# Altium schematic sheet TDS sensor 2.SchDoc
size A4; DocumentNumber: 4; SheetNumber: 4; SheetTotal: 4
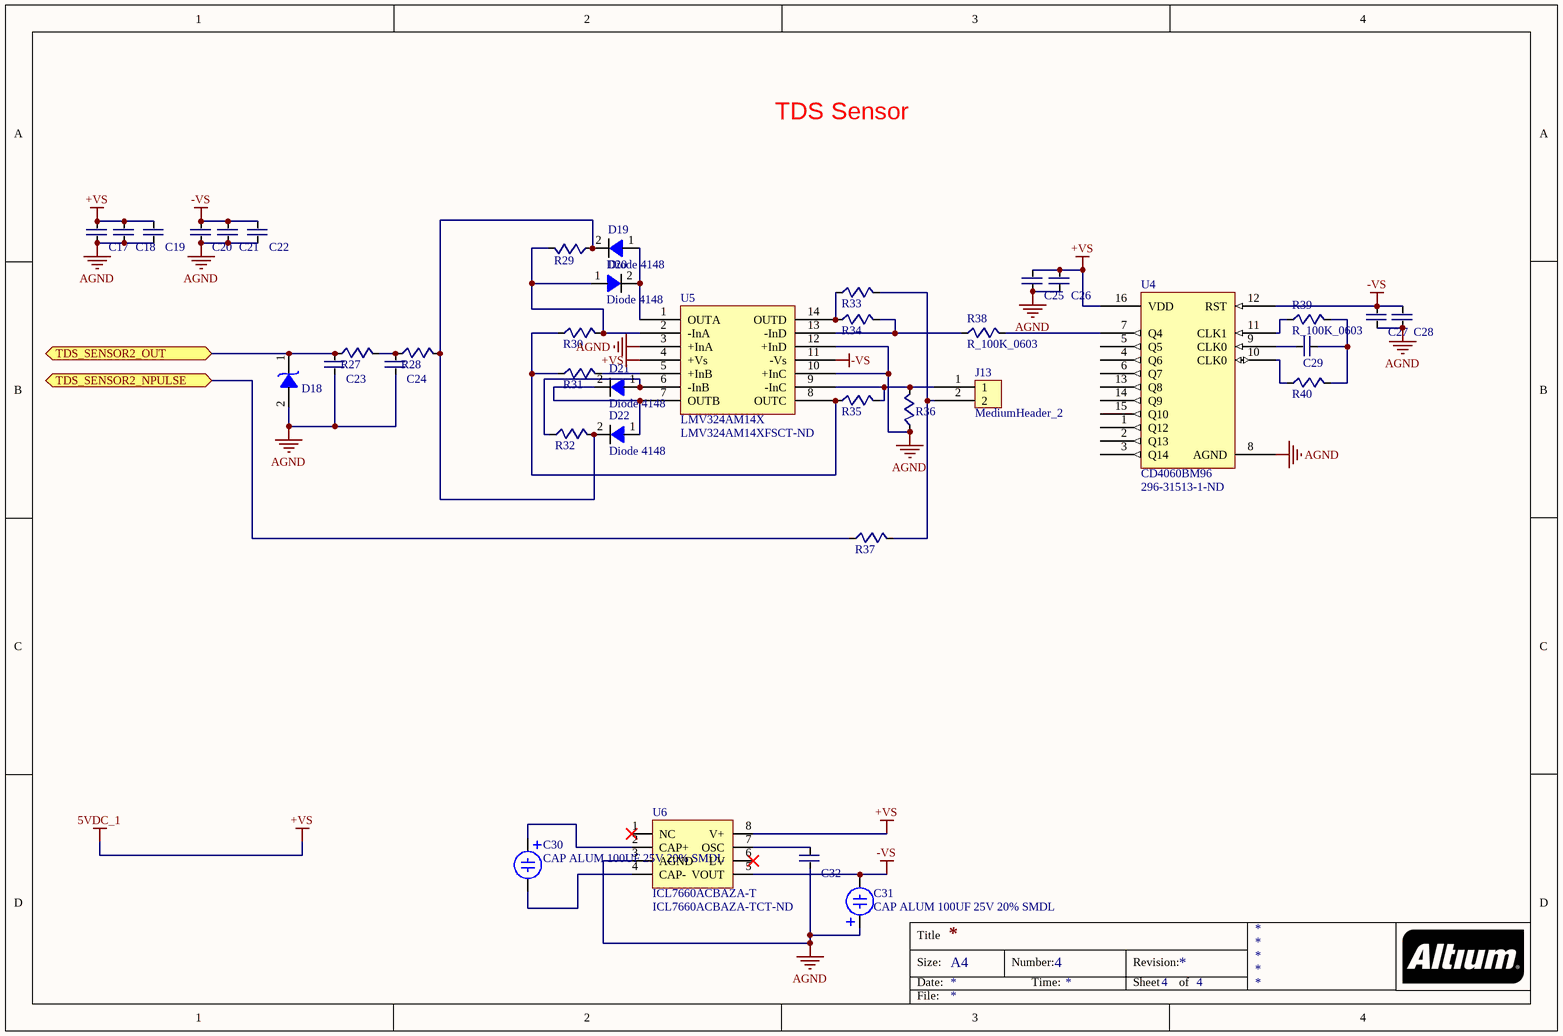
[diagram p0: TDS sensor 2.SchDoc]

## Parts
C17  100n Cer  [CN-SMD-0805]  (value not drawn)
C18  1n Cer  [CN-SMD-0805]  (value not drawn)
C19  10n Cer  [CN-SMD-0805]  (value not drawn)
C20  100n Cer  [CN-SMD-0805]  (value not drawn)
C21  1n Cer  [CN-SMD-0805]  (value not drawn)
C22  10n Cer  [CN-SMD-0805]  (value not drawn)
C23  10u Cer  [CN-SMD-0805]  (value not drawn)
C24  10u Cer  [CN-SMD-0805]  (value not drawn)
C25  10n Cer  [CN-SMD-0805]  (value not drawn)
C26  100n Cer  [CN-SMD-0805]  (value not drawn)
C27  10n Cer  [CN-SMD-0805]  (value not drawn)
C28  100n Cer  [CN-SMD-0805]  (value not drawn)
C29  1n Cer  [CN-SMD-0805]  (value not drawn)
C30  CAP ALUM 100UF 25V 20% SMDL  [CAPALU_SM_5.3x5.3]
C31  CAP ALUM 100UF 25V 20% SMDL  [CAPALU_SM_5.3x5.3]
C32  100n Cer  [CN-SMD-0805]  (value not drawn)
D18  Diode_SS34  [DO-214AB_MOD_EXT]  (value not drawn)
D19  Diode 4148  [CD3216-1206]
D20  Diode 4148  [CD3216-1206]
D21  Diode 4148  [CD3216-1206]
D22  Diode 4148  [CD3216-1206]
J13  MediumHeader_2  [Medium - Header 2]
R27  R_10K_0603  [RES-SMD-0603]  (value not drawn)
R28  R_10K_0603  [RES-SMD-0603]  (value not drawn)
R29  R_10K_0603  [RES-SMD-0603]  (value not drawn)
R30  R_10K_0603  [RES-SMD-0603]  (value not drawn)
R31  R_10K_0603  [RES-SMD-0603]  (value not drawn)
R32  R_10K_0603  [RES-SMD-0603]  (value not drawn)
R33  R_0R_0603  [RES-SMD-0603]  (value not drawn)
R34  R_4K99_0603  [RES-SMD-0603]  (value not drawn)
R35  R_4K99_0603  [RES-SMD-0603]  (value not drawn)
R36  R_1M_0603  [RES-SMD-0603]  (value not drawn)
R37  R_0R_0603  [RES-SMD-0603]  (value not drawn)
R38  R_100K_0603  [RES-SMD-0603]
R39  R_100K_0603  [RES-SMD-0603]
R40  R_10K_0603  [RES-SMD-0603]  (value not drawn)
U4  CD4060BM96  Supplier Part Number 1: 296-31513-1-ND  [SOIC_16]
U5  LMV324AM14X  Supplier Part Number 1: LMV324AM14XFSCT-ND  [SOIC-14]
U6  ICL7660ACBAZA-T  Supplier Part Number 1: ICL7660ACBAZA-TCT-ND  [SOIC-8_MOD_24LC128]

## Ports
TDS_SENSOR2_NPULSE, TDS_SENSOR2_OUT

## Nets
+VS: C17.2 C18.2 C19.2 C25.2 C26.2 U4.16(VDD) U5.4(+Vs) U6.8(V+)  [also labelled 5VDC_1]
-VS: C20.2 C21.2 C22.2 C27.2 C28.2 C31.2 U4.12(RST) U5.11(-Vs) U6.5(VOUT)
AGND: C17.1 C18.1 C19.1 C20.1 C21.1 C22.1 C23.1 C24.1 C25.1 C26.1 C27.1 C28.1 C31.1 C32.1 D18.2 R36.1 U4.8(AGND) U5.3(+InA) U5.10(+InC) U5.12(+InD) U6.3(AGND)
TDS_SENSOR2_NPULSE: R37.1 ; port TDS_SENSOR2_NPULSE
TDS_SENSOR2_OUT: C23.2 D18.1 R27.1 ; port TDS_SENSOR2_OUT
NetC24_2: C24.2 R27.2 R28.1
NetC29_1: C29.1 U4.9(CLK0)
NetC29_2: C29.2 R39.2 R40.2
NetC30_1: C30.1 U6.2(CAP+)
NetC30_2: C30.2 U6.4(CAP-)
NetC32_2: C32.2 U6.7(OSC)
NetD19_1: D19.1 D20.2 U5.1(OUTA)
NetD19_2: D19.2 D22.2 R28.2 R29.1 R32.2
NetD20_1: D20.1 R29.2 R30.2 U5.2(-InA)
NetD21_1: D21.1 R32.1 U5.6(-InB)
NetD21_2: D21.2 D22.1 U5.7(OUTB)
NetJ13_1: J13.1 R35.2 R36.2 U5.9(-InC)
NetJ13_2: J13.2 R33.2 R37.2
NetR30_1: R30.1 R31.1 R35.1 U5.8(OUTC)
NetR31_2: R31.2 U5.5(+InB)
NetR33_1: R33.1 R34.1 U5.14(OUTD)
NetR34_2: R34.2 R38.1 U5.13(-InD)
NetR38_2: R38.2 U4.7(Q4)
NetR39_1: R39.1 U4.11(CLK1)
NetR40_1: R40.1 U4.10(CLK0)

Not connected (* = marked no-connect by the designer): U4 1(Q12) 2(Q13) 3(Q14) 4(Q6) 5(Q5) 6(Q7) 13(Q8) 14(Q9) 15(Q10); U6 1(NC)* 6(LV)*

## Notes on the sheet
- TDS Sensor
- Title
- Size:
- Date:
- A4
- Number:
- Time:
- Revision:
- Sheet
- of
- File:

## Library data of the parts
C17 C20 C26 C28 C32 = CAPC0805_104: CAP CER 0.1UF 25V 10% X7R 0805; Supplier 1: Digi-Key; Supplier Part Number 1: 399-1168-2-ND
C18 C21 C29 = CAPC0805_102: CAP CER 1000PF 50V 10% X7R 0805; Supplier 1: Digi-Key; Supplier Part Number 1: 399-1147-1-ND
C19 C22 C25 C27 = CAPC0805_103: CAP CER 10000PF 100V X7R 0805; Supplier 1: Digi-Key; Supplier Part Number 1: 399-1159-1-ND
C23 C24 = CAPC0805_106: CAP CER 10UF 6.3V 10% X7R 0805; Supplier 1: Digi-Key; Supplier Part Number 1: 587-2780-2-ND
C30 C31 = CAPALU100U25V: CAP ALUM 100UF 25V 20% SMD; Supplier 1: Digi-Key; Supplier Part Number 1: 493-2113-1-ND
D18 = Diode_SS34: DIODE SCHOTTKY 40V 3A SMC; Supplier 1: Digi-Key; Supplier Part Number 1: SS34FSCT-ND
D19-D22 = Diode_4148: DIODE SWITCHING 75V 0.2A LLDS; Supplier 1: Digi-Key; Supplier Part Number 1: 568-1749-1-ND
R27-R32 R40 = RES0603_10K: RES 10.0K OHM 1/10W 1% 0603 SMD; Supplier 1: Digi-Key; Supplier Part Number 1: 311-10.0KHRCT-ND
R33 R37 = RES0603_0R: RES 0.0 OHM 1/10W JUMP 0603 SMD; Supplier 1: Digi-Key; Supplier Part Number 1: 311-0.0GRDKR-ND
R34 R35 = RES0603_4K99: RES 4.99K OHM 1/10W 1% 0603 SMD; Supplier 1: Digi-Key; Supplier Part Number 1: P4.99KHDKR-ND
R36 = RES0603_1M: RES 1M OHM 1/8W 1% 0603 SMD; Supplier 1: Digi-Key; Supplier Part Number 1: 311-1.50KHRDKR-ND
R38 R39 = RES0603_100K: RES 100K OHM 1/10W 1% 0603 SMD; Supplier 1: Digi-Key; Supplier Part Number 1: 311-1.50KHRDKR-ND
U4 = CD4060BM: IC BINARY COUNTER/DIV/OSC 16SOIC; Supplier 1: Digi-Key
U5 = LMV324A: IC OPAMP VFB 1.4MHZ RRO 14SOIC; Supplier 1: Digi-Key
U6 = ICL7660: IC REG SWTCHD CAP INV 45MA 8SOIC; Creator: Nguyen Ba Bien; Supplier 1: Digi-Key